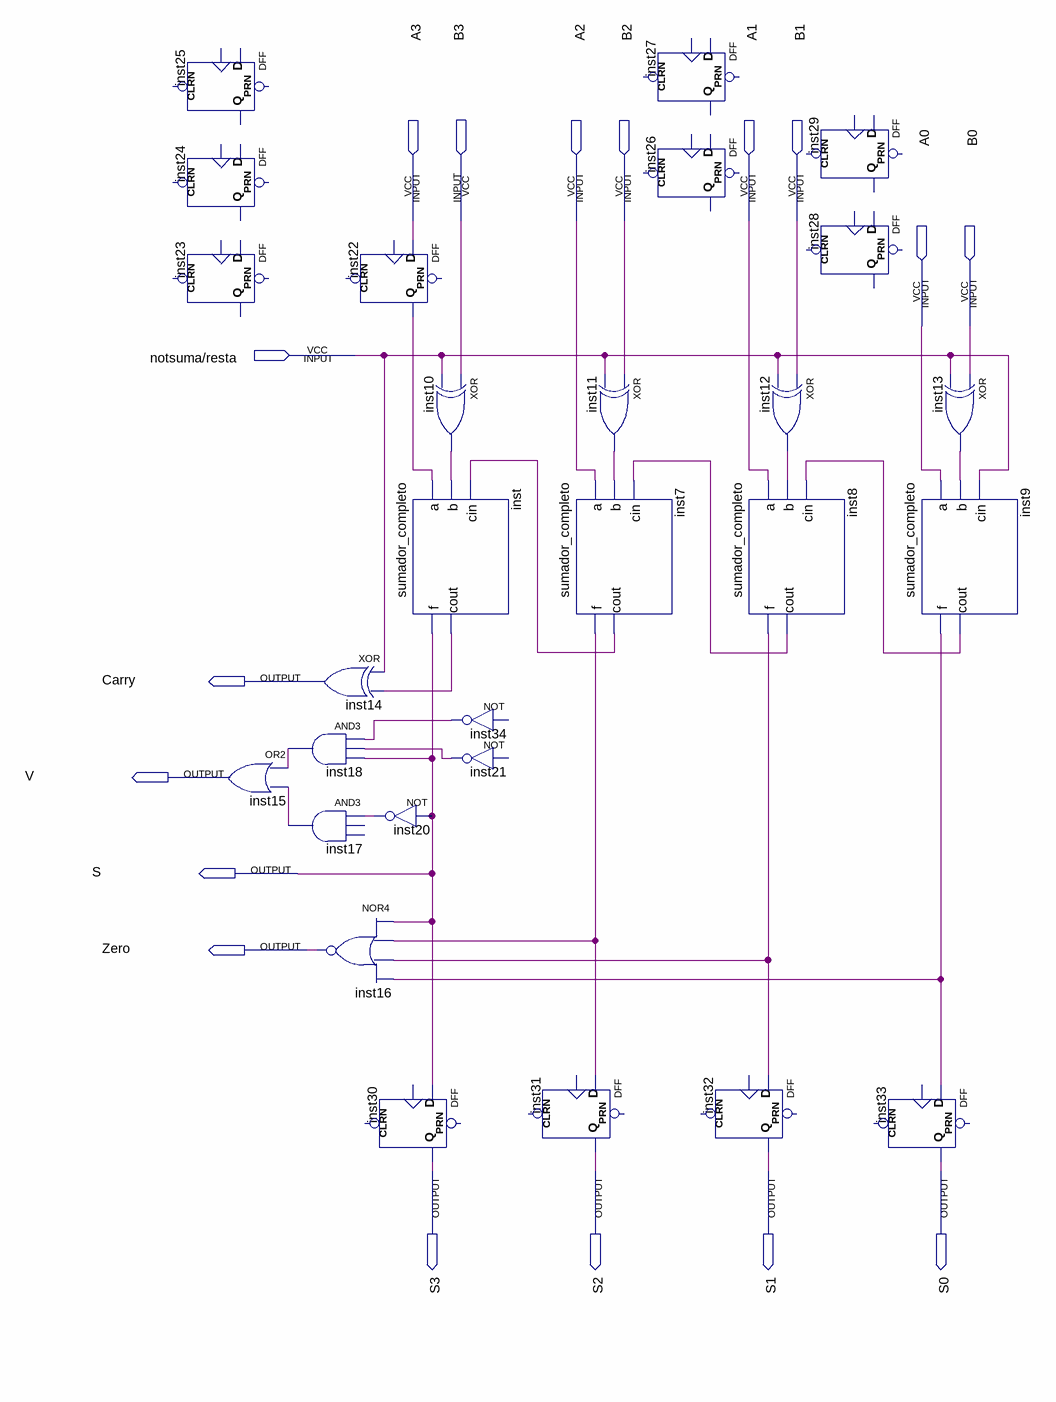
[diagram p0: schematic sheet]
// Quartus schematic s_r_4bits.bdf as structural Verilog: 28 symbols, 17 pins
module s_r_4bits (
  input  A3,
  input  B3,
  input  A2,
  input  B2,
  input  A1,
  input  B1,
  input  A0,
  input  B0,
  input  \notsuma/resta ,
  output Carry,
  output V,
  output S,
  output Zero,
  output S3,
  output S2,
  output S1,
  output S0
);

  wire inst7_cout, inst7_f, inst8_cout, inst8_f, inst9_cout, inst9_f, inst10_out, inst11_out, inst12_out,
       inst13_out, inst17_out, inst18_out, inst20_out, inst21_out, inst22_q, inst34_out, inst_cout;

  DFF inst25 ();  // open: CLRN, CLK, D, PRN, Q
  DFF inst24 ();  // open: CLRN, CLK, D, PRN, Q
  DFF inst23 ();  // open: CLRN, CLK, D, PRN, Q
  or inst15 (V, inst18_out, inst17_out);
  xor inst14 (Carry, \notsuma/resta , inst_cout);
  and inst18 (inst18_out, inst34_out, inst21_out, S);
  buf inst17 (inst17_out, inst20_out);  // AND3 open: IN2, IN3
  nor inst16 (Zero, S, inst7_f, inst8_f, inst9_f);
  DFF inst22 (.D(A3), .Q(inst22_q));  // open: CLRN, CLK, PRN
  sumador_completo inst (.a(inst22_q), .b(inst10_out), .cin(inst7_cout), .f(S), .cout(inst_cout));
  not inst20 (inst20_out, S);
  DFF inst30 (.D(S), .Q(S3));  // open: CLRN, CLK, PRN
  xor inst10 (inst10_out, B3, \notsuma/resta );
  // NOT inst34 has open pins: IN=open, OUT=inst34_out
  // NOT inst21 has open pins: IN=open, OUT=inst21_out
  sumador_completo inst7 (.a(A2), .b(inst11_out), .cin(inst8_cout), .f(inst7_f), .cout(inst7_cout));
  DFF inst31 (.D(inst7_f), .Q(S2));  // open: CLRN, CLK, PRN
  DFF inst27 ();  // open: CLRN, CLK, D, PRN, Q
  DFF inst26 ();  // open: CLRN, CLK, D, PRN, Q
  xor inst11 (inst11_out, B2, \notsuma/resta );
  DFF inst32 (.D(inst8_f), .Q(S1));  // open: CLRN, CLK, PRN
  xor inst12 (inst12_out, B1, \notsuma/resta );
  sumador_completo inst8 (.a(A1), .b(inst12_out), .cin(inst9_cout), .f(inst8_f), .cout(inst8_cout));
  DFF inst29 ();  // open: CLRN, CLK, D, PRN, Q
  DFF inst28 ();  // open: CLRN, CLK, D, PRN, Q
  DFF inst33 (.D(inst9_f), .Q(S0));  // open: CLRN, CLK, PRN
  xor inst13 (inst13_out, B0, \notsuma/resta );
  sumador_completo inst9 (.a(A0), .b(inst13_out), .cin(\notsuma/resta ), .f(inst9_f), .cout(inst9_cout));
endmodule
